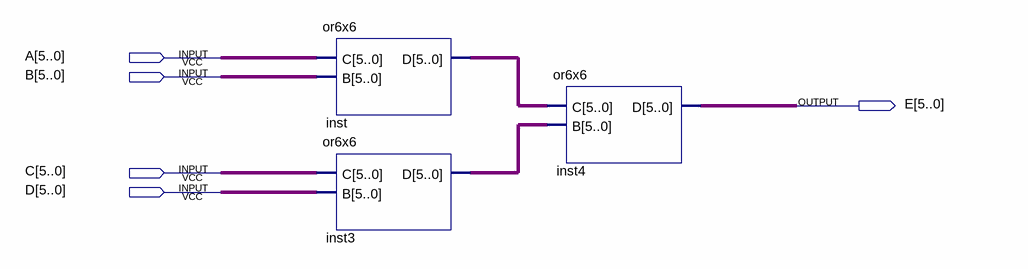
[diagram p0: schematic sheet]
// Quartus schematic orGiper.bdf as structural Verilog: 3 symbols, 5 pins
module orGiper (
  input  [5:0] A,
  input  [5:0] B,
  input  [5:0] C,
  input  [5:0] D,
  output [5:0] E
);

  wire [5:0] inst3_d, inst_d;

  or6x6 inst (.C(A), .B(B), .D(inst_d));
  or6x6 inst3 (.C(C), .B(D), .D(inst3_d));
  or6x6 inst4 (.C(inst_d), .B(inst3_d), .D(E));
endmodule
